# Altium schematic sheet esquematico.SchDoc
size A
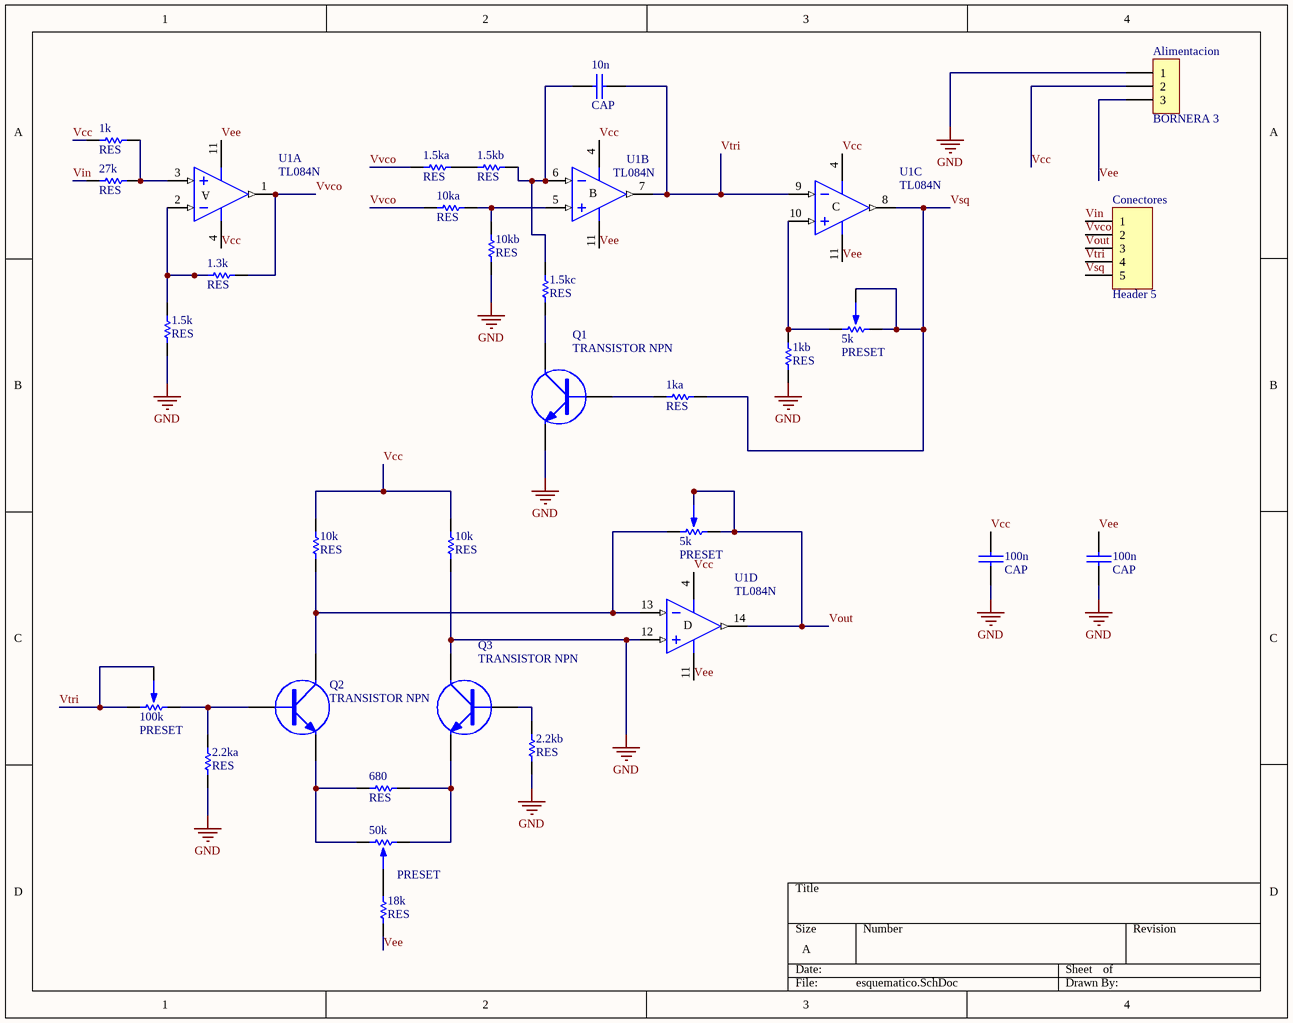
[diagram p0: esquematico.SchDoc]

## Parts
(Parts that share a designator on the sheet are numbered #1, #2 ... from top to bottom, then left to right.)
1.3k  RES  [1206]
1.5k  RES  [0805]
1.5ka  RES  [1206]
1.5kb  RES  [1206]
1.5kc  RES  [1206]
1k  RES  [1206]
1ka  RES  [1206]
1kb  RES  [1206]
2.2ka  RES  [1206]
2.2kb  RES  [1206]
5k#1  PRESET  [PRESET V]
5k#2  PRESET  [PRESET V]
10k#1  RES  [1206]
10k#2  RES  [1206]
10ka  RES  [1206]
10kb  RES  [1206]
10n  CAP  [CAP100]
18k  RES  [1206]
27k  RES  [1206]
50k  PRESET  [PRESET V]
100k  PRESET  [PRESET V]
100n#1  CAP  [CAP100]
100n#2  CAP  [CAP100]
680  RES  [1206]
Alimentacion  BORNERA 3  [BORNERA3]
Conectores  Header 5  [HDR1X5]
Q1  TRANSISTOR NPN  [TO92]
Q2  TRANSISTOR NPN  [TO92]
Q3  TRANSISTOR NPN  [TO92]
U1  TL084N  [N014]  (parts A,B,C,D of 4)

## Nets
GND: 1.5k.1 1kb.2 2.2ka.1 2.2kb.1 10k#2.1 10kb.1 100n#1.1 100n#2.1 Alimentacion.1 Q1.3(E) Q3.2(C) U1.12(IN+)
Vcc: 1k.1 10k#1.2 10k#2.2 100n#1.2 Alimentacion.2 U1.4(V+)
Vee: 18k.1 100n#2.2 Alimentacion.3 U1.11(V-)
Vin: 27k.1 Conectores.1
Vout: 5k#2.2 5k#2.3 Conectores.3 U1.14(OUT)
Vsq: 1ka.1 5k#1.2 5k#1.3 Conectores.5 U1.8(OUT)
Vtri: 10n.2 100k.1 100k.2 Conectores.4 U1.7(OUT) U1.9(IN-)
Vvco: 1.3k.2 1.5ka.1 10ka.1 Conectores.2 U1.1(OUT)
Net1.3k_1: 1.3k.1 1.5k.2 U1.2(IN-)
Net1.5ka_2: 1.5ka.2 1.5kb.1
Net1.5kb_2: 1.5kb.2 1.5kc.2 10n.1 U1.6(IN-)
Net1.5kc_1: 1.5kc.1 Q1.2(C)
Net1k_2: 1k.2 27k.2 U1.3(IN+)
Net1ka_2: 1ka.2 Q1.1(B)
Net1kb_1: 1kb.1 5k#1.1 U1.10(IN+)
Net2.2ka_2: 2.2ka.2 100k.3 Q2.1(B)
Net2.2kb_2: 2.2kb.2 Q3.1(B)
Net5k#2_1: 5k#2.1 10k#1.1 Q2.2(C) U1.13(IN-)
Net10ka_2: 10ka.2 10kb.2 U1.5(IN+)
Net18k_2: 18k.2 50k.2
Net50k_1: 50k.1 680.2 Q3.3(E)
Net50k_3: 50k.3 680.1 Q2.3(E)

## Notes on the sheet
- (in symbol TL084N, part A) A
- (in symbol TL084N, part B) B
- (in symbol TL084N, part C) C
- (in symbol TL084N, part D) D

## Library data of the parts
Conectores = Header 5: Header, 5-Pin; LatestRevisionDate: 17-Jul-2002; LatestRevisionNote: Re-released for DXP Platform.; Publisher: Altium Limited
U1 = TL084N: JFET-Input Operational Amplifier; Published: 16-Jan-2001; LatestRevisionDate: 04-Mar-2005; LatestRevisionNote: Stylized 3D Model Added.; DatasheetVersion: Feb-1999; PackageVersion: Oct-1995; PackageReference: N014; Publisher: Altium Limited; PackageDescription: DIP; 14 Leads; Row Spacing 7.62 mm; Pitch 2.54 mm; ComponentLink1Description: Manufacturer Link; ComponentLink1URL: http://www.ti.com/; ComponentLink2Description: Datasheet; ComponentLink2URL: http://www-s.ti.com/sc/ds/tl084.pdf